# Altium project Controller.PrjPcb
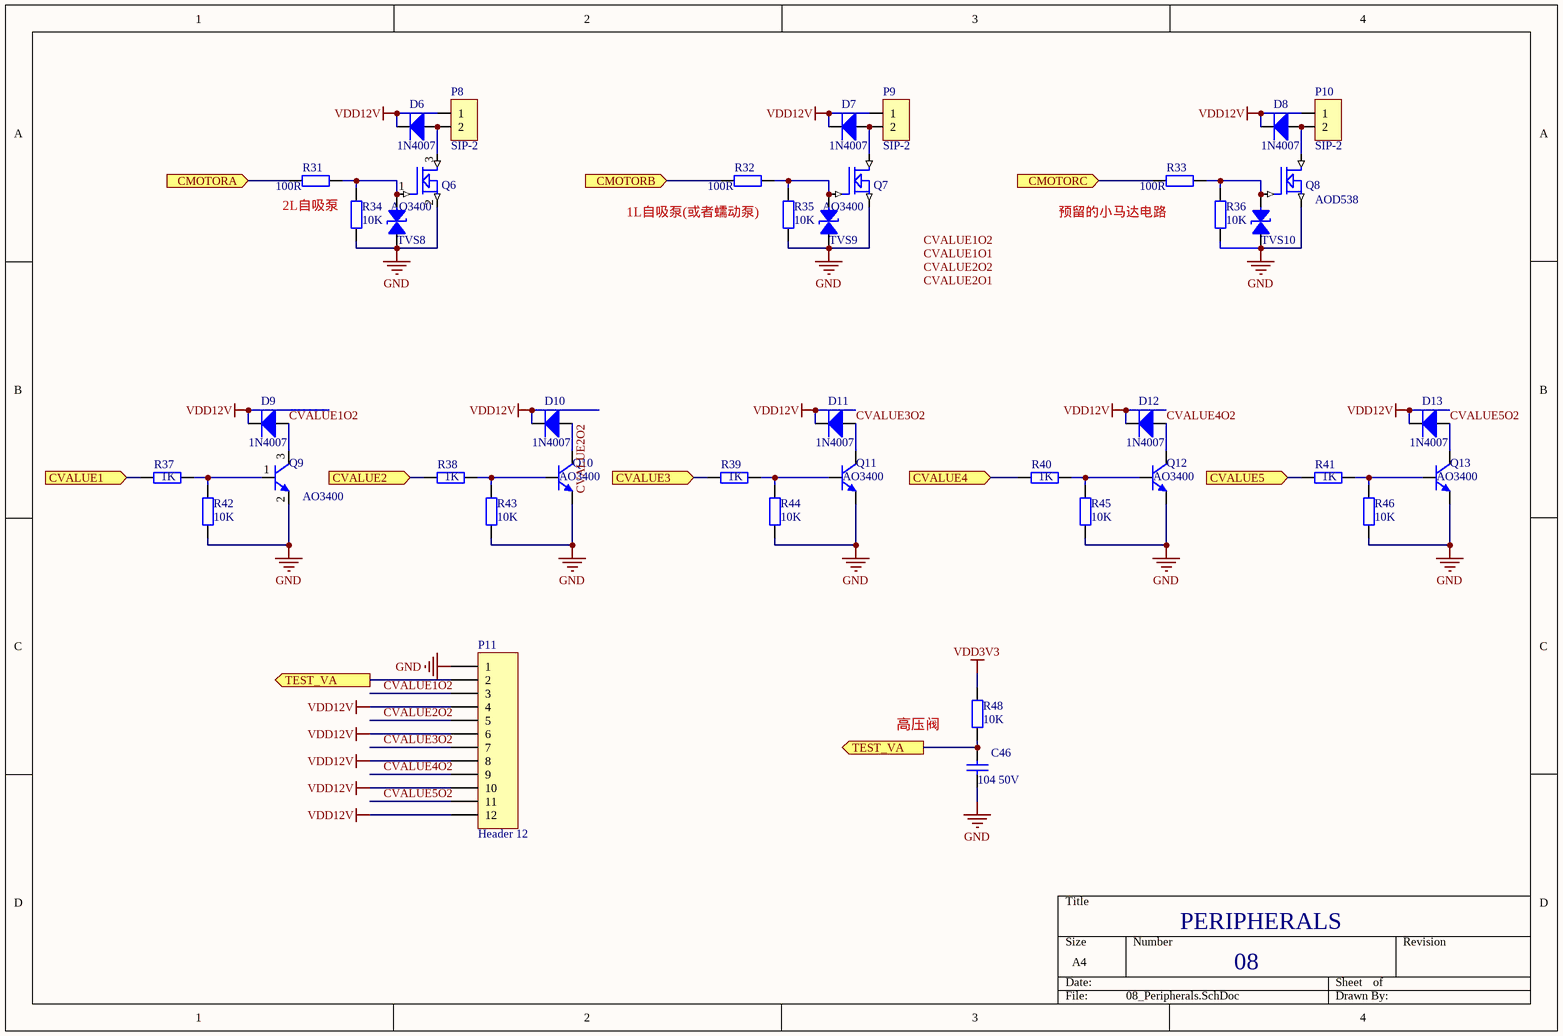
[diagram p0: 08_Peripherals.SchDoc]
2 sheets, 46 parts. Net scope: global (net labels, ports and power ports of the same name join across sheets).
Board file: 电解模块主控板_V1.1_ZM_20211015.PcbDoc
Sheets:
  08_Peripherals.SchDoc
  10_Wifi.SchDoc

## Sheet 08_Peripherals.SchDoc
size A4

### Parts
C46  104 50V  [SMD-0603C]
D6  1N4007  [DO-214-AC]
D7  1N4007  [DO-214-AC]
D8  1N4007  [DO-214-AC]
D9  1N4007  [DO-214-AC]
D10  1N4007  [DO-214-AC]
D11  1N4007  [DO-214-AC]
D12  1N4007  [DO-214-AC]
D13  1N4007  [DO-214-AC]
P8  SIP-2  [SIP-2A]
P9  SIP-2  [SIP-2A]
P10  SIP-2  [VH-AW-3.96*2P]
P11  Header 12  [12X2.54MMZ]
Q6  AO3400  [SOT-23]
Q7  AO3400  [SOT-23]
Q8  AOD538  [TO252]
Q9  AO3400  [SOT-23]
Q10  AO3400  [SOT-23]
Q11  AO3400  [SOT-23]
Q12  AO3400  [SOT-23]
Q13  AO3400  [SOT-23]
R31  100R  [SMD-0603]
R32  100R  [SMD-0603]
R33  100R  [SMD-0603]
R34  10K  [SMD-0603]
R35  10K  [SMD-0603]
R36  10K  [SMD-0603]
R37  1K  [SMD-0603]
R38  1K  [SMD-0603]
R39  1K  [SMD-0603]
R40  1K  [SMD-0603]
R41  1K  [SMD-0603]
R42  10K  [SMD-0603]
R43  10K  [SMD-0603]
R44  10K  [SMD-0603]
R45  10K  [SMD-0603]
R46  10K  [SMD-0603]
R48  10K  [SMD-0603]
TVS8  ESD5Z5.0CT1G  [SOD-523]  (value not drawn)
TVS9  ESD5Z5.0CT1G  [SOD-523]  (value not drawn)
TVS10  ESD5Z5.0CT1G  [SOD-523]  (value not drawn)

### Ports
CMOTORA (in), CMOTORB (in), CMOTORC (in), CVALUE1 (in), CVALUE2 (in), CVALUE3 (in), CVALUE4 (in), CVALUE5 (in), TEST_VA (out)

### Nets
GND: C46.1 P11.1 Q6.2(S) Q7.2(S) Q8.2(S) Q9.2(E) Q10.2(E) Q11.2(E) Q12.2(E) Q13.2(E) R34.2 R35.2 R36.2 R42.2 R43.2 R44.2 R45.2 R46.2 TVS8.1(A) TVS9.1(A) TVS10.1(A)
VDD3V3: R48.2
VDD12V: D6.2(K) D7.2(K) D8.2(K) D9.2(K) D10.2(K) D11.2(K) D12.2(K) D13.2(K) P8.1 P9.1 P10.1 P11.4 P11.6 P11.8 P11.10 P11.12
CVALUE1O2: D9.1(A) P11.3 Q9.3(C)
CVALUE2O2: D10.1(A) P11.5 Q10.3(C)
CVALUE3O2: D11.1(A) P11.7 Q11.3(C)
CVALUE4O2: D12.1(A) P11.9 Q12.3(C)
CVALUE5O2: D13.1(A) P11.11 Q13.3(C)
NetC46_2: C46.2 P11.2 R48.1 ; port TEST_VA
NetD6_1: D6.1(A) P8.2 Q6.3(D)
NetD7_1: D7.1(A) P9.2 Q7.3(D)
NetD8_1: D8.1(A) P10.2 Q8.3(D)
NetQ6_1: Q6.1(G) R31.1 R34.1 TVS8.2(B)
NetQ7_1: Q7.1(G) R32.1 R35.1 TVS9.2(B)
NetQ8_1: Q8.1(G) R33.1 R36.1 TVS10.2(B)
NetQ9_1: Q9.1(B) R37.1 R42.1
NetQ10_1: Q10.1(B) R38.1 R43.1
NetQ11_1: Q11.1(B) R39.1 R44.1
NetQ12_1: Q12.1(B) R40.1 R45.1
NetQ13_1: Q13.1(B) R41.1 R46.1
NetR31_2: R31.2 ; port CMOTORA
NetR32_2: R32.2 ; port CMOTORB
NetR33_2: R33.2 ; port CMOTORC
NetR37_2: R37.2 ; port CVALUE1
NetR38_2: R38.2 ; port CVALUE2
NetR39_2: R39.2 ; port CVALUE3
NetR40_2: R40.2 ; port CVALUE4
NetR41_2: R41.2 ; port CVALUE5

### Notes on the sheet
- (near R31) 2L自吸泵
- (near R32) 1L自吸泵(或者蠕动泵)
- 预留的小马达电路
- 高压阀
- PERIPHERALS
- 08
- Labels drawn without touching a wire or pin: CVALUE1O1, CVALUE1O2, CVALUE2O1, CVALUE2O2

### Library data of the parts
C46 = CAP4: 贴片电容 10%
D6-D13 = DIODE2: 贴片二极管
P8-P10 = SIP-2: XH2.54 2P 立贴
P11 = Header 12: Header, 12-Pin; LatestRevisionDate: 17-Jul-2002; LatestRevisionNote: Re-released for DXP Platform.; Publisher: Altium Limited
Q6-Q8 = MOSFET N
Q9-Q13 = NPN-1: 三极管
R31-R46 R48 = RES-SOP: 贴片电阻 5%
TVS8-TVS10 = TVS-1: TVS

## Sheet 10_Wifi.SchDoc
size A4
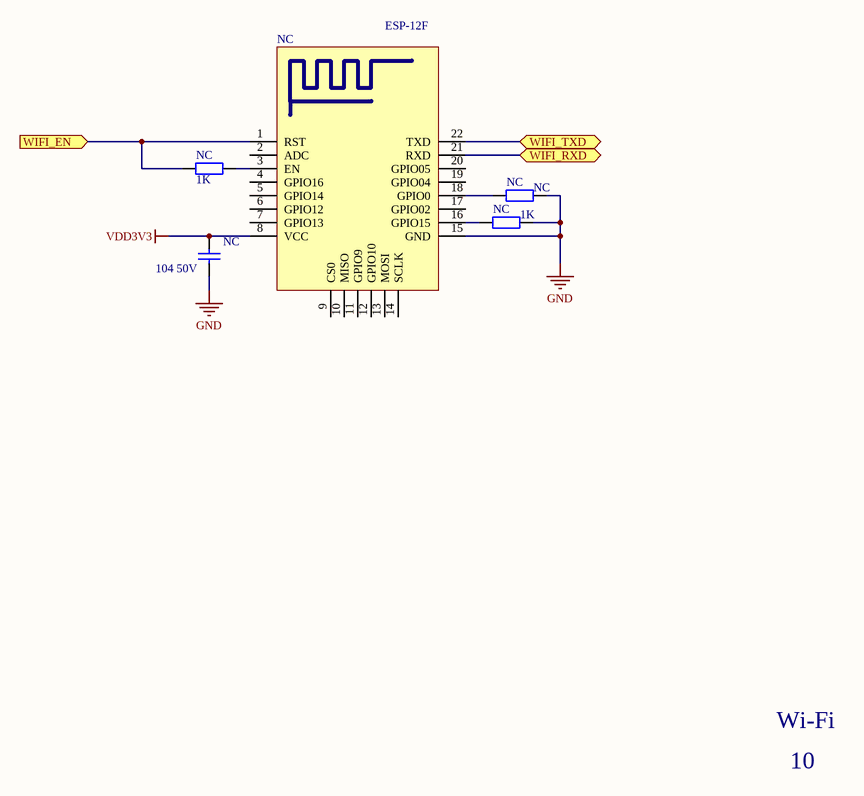
[diagram p1: 10_Wifi.SchDoc]

### Parts
(Parts that share a designator on the sheet are numbered #1, #2 ... from top to bottom, then left to right.)
NC#1  ESP-12F  [ESP-12F]
NC#2  1K  [SMD-0603]
NC#3  NC  [SMD-0603]
NC#4  1K  [SMD-0603]
NC#5  104 50V  [SMD-0603C]

### Ports
WIFI_EN (in), WIFI_RXD (bidir), WIFI_TXD (bidir)

### Nets
GND: NC#1.15(GND) NC#3.1 NC#4.2 NC#5.1
VDD3V3: NC#1.8(VCC) NC#5.2
NetNC#1_1: NC#1.1(RST) NC#2.1 ; port WIFI_EN
NetNC#1_3: NC#1.3(EN) NC#2.2
NetNC#1_16: NC#1.16(GPIO15) NC#4.1
NetNC#1_18: NC#1.18(GPIO0) NC#3.2
NetNC#1_21: NC#1.21(RXD) ; port WIFI_RXD
NetNC#1_22: NC#1.22(TXD) ; port WIFI_TXD

Not connected (* = marked no-connect by the designer): NC#1 2(ADC) 4(GPIO16) 5(GPIO14) 6(GPIO12) 7(GPIO13) 9(CS0) 10(MISO) 11(GPIO9) 12(GPIO10) 13(MOSI) 14(SCLK) 17(GPIO02) 19(GPIO04) 20(GPIO05)

### Notes on the sheet
- Wi-Fi
- 10

### Library data of the parts
NC#1 = ESP8266
NC#2-NC#4 = RES2: 贴片电阻 5%
NC#5 = CAP4: 贴片电容 20%

## Nets that join several sheets
GND: 08_Peripherals (21 pins), 10_Wifi (NC#1.15 NC#3.1 NC#4.2 NC#5.1)
VDD3V3: 08_Peripherals (R48.2), 10_Wifi (NC#1.8 NC#5.2)